# EAGLE design darkgame-motor (EAGLE 6.1)
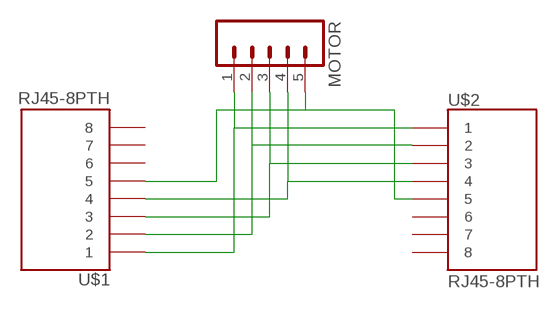
[diagram p0: schematic, sheet 1]

## Parts
MOTOR  M05PTH  [1X05]
U$1  RJ45-8PTH  [RJ45-8]
U$2  RJ45-8PTH  [RJ45-8]

## Nets
N$1: MOTOR.1 U$1.1 U$2.1
N$2: MOTOR.2 U$1.2 U$2.2
N$3: MOTOR.3 U$1.3 U$2.3
N$4: MOTOR.4 U$1.4 U$2.4
N$5: MOTOR.5 U$1.5 U$2.5
Unconnected: U$1.6 U$1.7 U$1.8 U$2.6 U$2.7 U$2.8

## Library data of the parts
MOTOR = SparkFun-Connectors:M05: Header 5 Standard 5-pin 0.1" header. Use with straight break away headers (SKU : PRT-00116), right angle break away headers (PRT-00553), swiss pins (PRT-00743), machine pins (PRT-00117), and female headers (PRT-00115). Molex polarized connector foot print use with SKU : PRT-08230 with associated crimp pins and housings.
U$1 U$2 = SparkFun-Connectors:RJ45-8: RJ45 Jack Simple RJ45, 8-pin connection - connector for common Cat5, Cat5e, and Cat6 Ethernet cables. Footprint not yet proven in production. Connector sku is PRT-00643; Breakout PCB sku is BOB-00716.

## Board
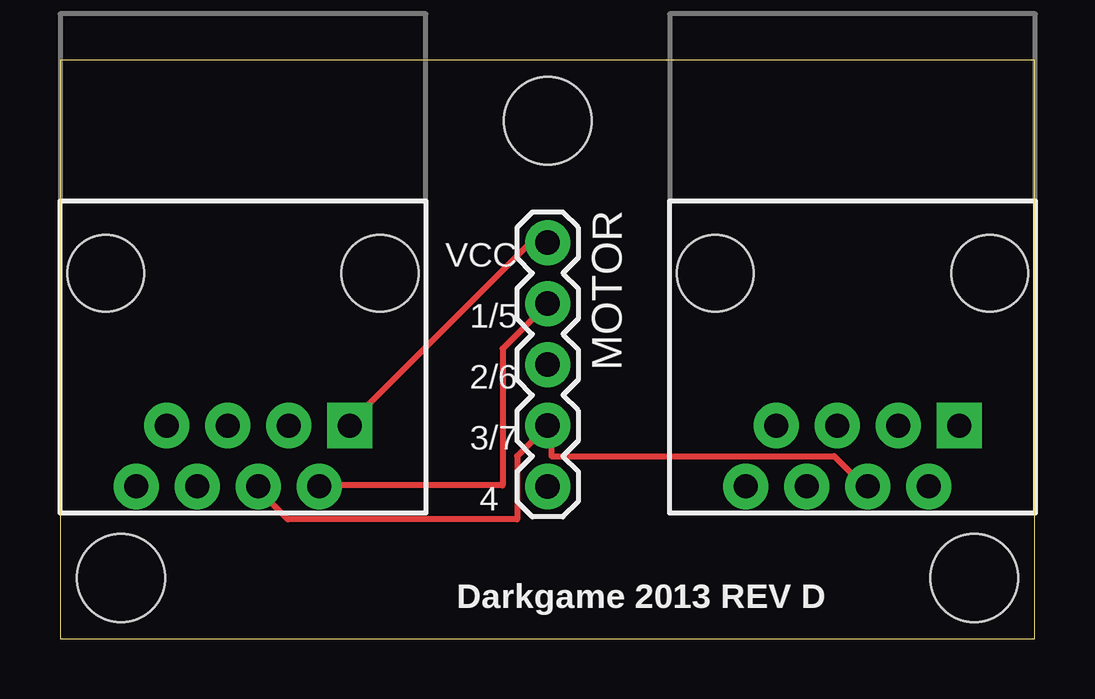
[diagram p1: board, top side]
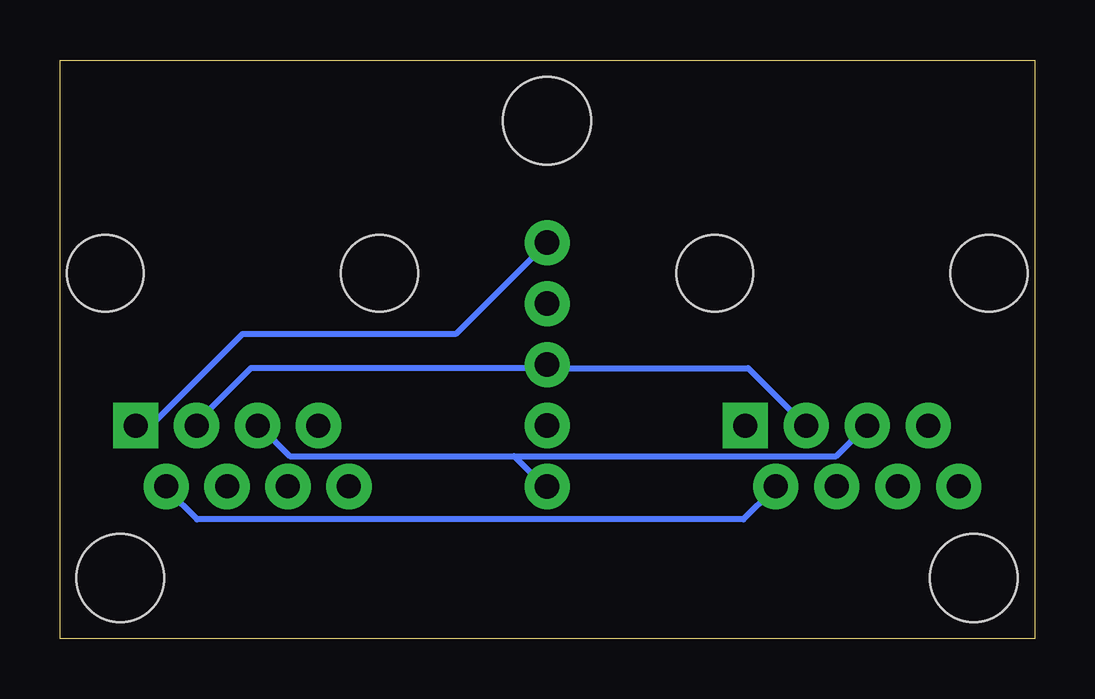
[diagram p2: board, bottom side, seen from below]

Size 40.61 x 24.12 mm. Coordinates in mm from the lower left corner, seen from the top.
Outline: 0,0 40.62,0 40.62,24.12 0,24.12 0,0
Copper layers (1*16): Top 0.035mm / dielectric 1.5mm / Bottom 0.035mm
Design rules: minimum track width 10mil, minimum drill 24mil, track to track 8mil, track to pad 8mil, pad to pad 8mil, via to via 8mil, smd to smd 8mil, copper to edge 40mil, drill to drill 8mil, minimum pad ring 10mil, minimum via ring 8mil, stop-mask expansion 4mil, vias tented up to drill 0mil, thermal gap 10mil
Holes 3.66 mm at 2.54,2.54 38.1,2.54 20.32,21.59

### Footprints (pad centres in the part's own frame; a part is rotated, then mirrored left to right if it is on the bottom)
1X05 = drill 1.016 pad 1.88: 1 0,0; 2 2.54,0; 3 5.08,0; 4 7.62,0; 5 10.16,0
RJ45-8 = drill 1 pad 1.88 square: 1 -4.445,6.35 | drill 1 pad 1.88: 2 -3.175,8.89; 3 -1.905,6.35; 4 -0.635,8.89; 5 0.635,6.35; 6 1.905,8.89; 7 3.175,6.35; 8 4.445,8.89 | hole 3.2: -5.715,0; 5.715,0

### Placement (x,y rotation side)
MOTOR  20.32,16.51 270 top
U$1  33.02,15.24 180 top
U$2  7.62,15.24 180 top

### Tracks (layer width: path | path; a pad name or v marks a point on that pad's centre or on a via)
N$1
  Top 0.254: U$2.1 12.14,9.04 19.46,16.36 20.27,16.36 MOTOR.1
  Bottom 0.254: MOTOR.1 24.13,12.7 33.02,12.7 36.83,8.89 U$1.1
N$2
  Top 0.254: MOTOR.2 18.44,12.09 18.44,6.4 10.92,6.4 U$2.2
  Bottom 0.254: U$1.2 36.12,6.2 34.9,4.98 12.14,4.98 10.92,6.2 U$2.2
N$3
  Bottom 0.254: U$2.3 9.7,9.04 11.94,11.28 20.27,11.28 MOTOR.3 20.47,11.28 32.66,11.28 34.9,9.04 U$1.3
N$4
  Top 0.254: U$2.4 8.28,6.2 9.5,4.98 19.05,4.98 19.05,7.62 MOTOR.4 20.47,8.84 20.47,7.62 32.26,7.62 33.48,6.4 U$1.4
N$5
  Bottom 0.254: 21.69,7.62 20.47,6.4 MOTOR.5 | 21.69,7.62 31.04,7.62 32.26,8.84 U$1.5 | 21.69,7.62 8.28,7.62 7.06,8.84 U$2.5

### Text on the board
tPlace: VCC | 1/5 | 2/6 | 3/7 | 4 | Darkgame 2013 REV D